# Altium schematic sheet POWER.SchDoc
size A
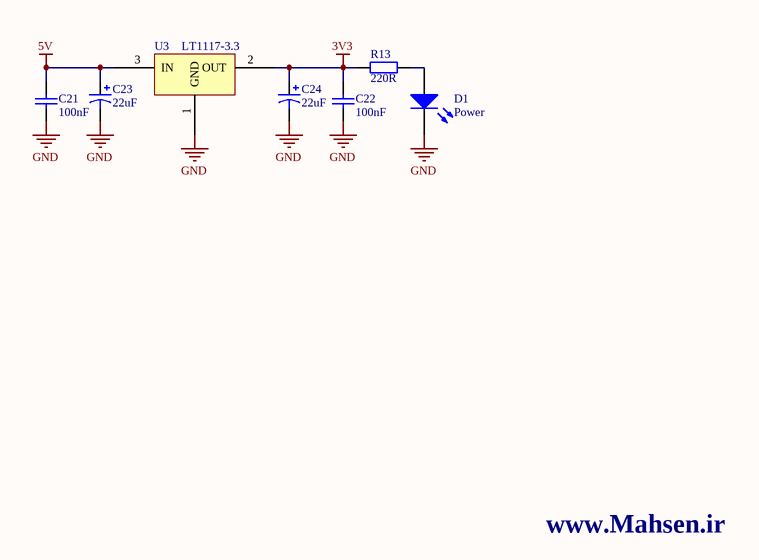
[diagram p0: POWER.SchDoc]

## Parts
C21  100nF  [0805]
C22  100nF  [0805]
C23  22uF  [C0805]
C24  22uF  [C0805]
D1  Power  [3.5X2.8X1.9]
R13  220R  [0805]
U3  LT1117-3.3  [SOT223_4]

## Nets
3V3: C22.1 C24.1 R13.1 U3.2(OUT)
5V: C21.1 C23.1 U3.3(IN)
GND: C21.2 C22.2 C23.2 C24.2 D1.2(K) U3.1(GND)
NetD1_1: D1.1(A) R13.2

## Notes on the sheet
- www.Mahsen.ir

## Library data of the parts
C21 C22 = Cap: Capacitor; Published: 8-Jun-2000; LatestRevisionDate: 17-Jul-2002; LatestRevisionNote: Re-released for DXP Platform.; PackageReference: RAD-0.3; Publisher: Altium Limited; PackageDescription: Radial Cap, Thru-Hole; 2 Leads; 0.3 in Pin Spacing; Value: 100nF
C23 C24 = Cap Pol3: Polarized Capacitor (Surface Mount); Published: 8-Jun-2000; LatestRevisionDate: 29-May-2009; LatestRevisionNote: IPC-7351 Footprint Added.; PackageReference: C0805; Publisher: Altium Limited; PackageDescription: Chip Capacitor; Value: 22uF
D1 = LED3: Typical BLUE SiC LED; Published: 8-Jun-2000; LatestRevisionDate: 17-Dec-2003; LatestRevisionNote: PCB Footprint replaced.; DatasheetVersion: 16-Apr-2002; PackageVersion: 16-Apr-2002; PackageReference: 3.5X2.8X1.9; Publisher: Altium Limited; PackageDescription: SM LED; 2 C-Bend Leads; Body 3.5 x 2.8 x 1.9 mm, inc leads (LxWxH typ)
R13 = Res2: Resistor; Published: 8-Jun-2000; LatestRevisionDate: 17-Jul-2002; LatestRevisionNote: Re-released for DXP Platform.; PackageReference: AXIAL-0.4; Publisher: Altium Limited; PackageDescription: Axial Device, Thru-Hole; 2 Leads; 0.4 in Pin Spacing; Value: 220R